# EAGLE schematic 9dof_Level_Converter (EAGLE 6.2)
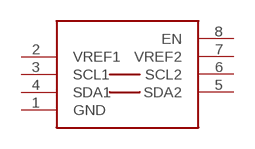
[diagram p0: schematic, sheet 1]

## Parts
U$1  PCA9306  [PSOP-8]
Unconnected: U$1.1(GND) U$1.2(VREF1) U$1.3(SCL1) U$1.4(SDA1) U$1.5(SDA2) U$1.6(SCL2) U$1.7(VREF2) U$1.8(EN)

## Library data of the parts
U$1 = SparkFun:PCA9306